# EAGLE design Ziliani-Sistema_Irrigazione (EAGLE 9.6.1)
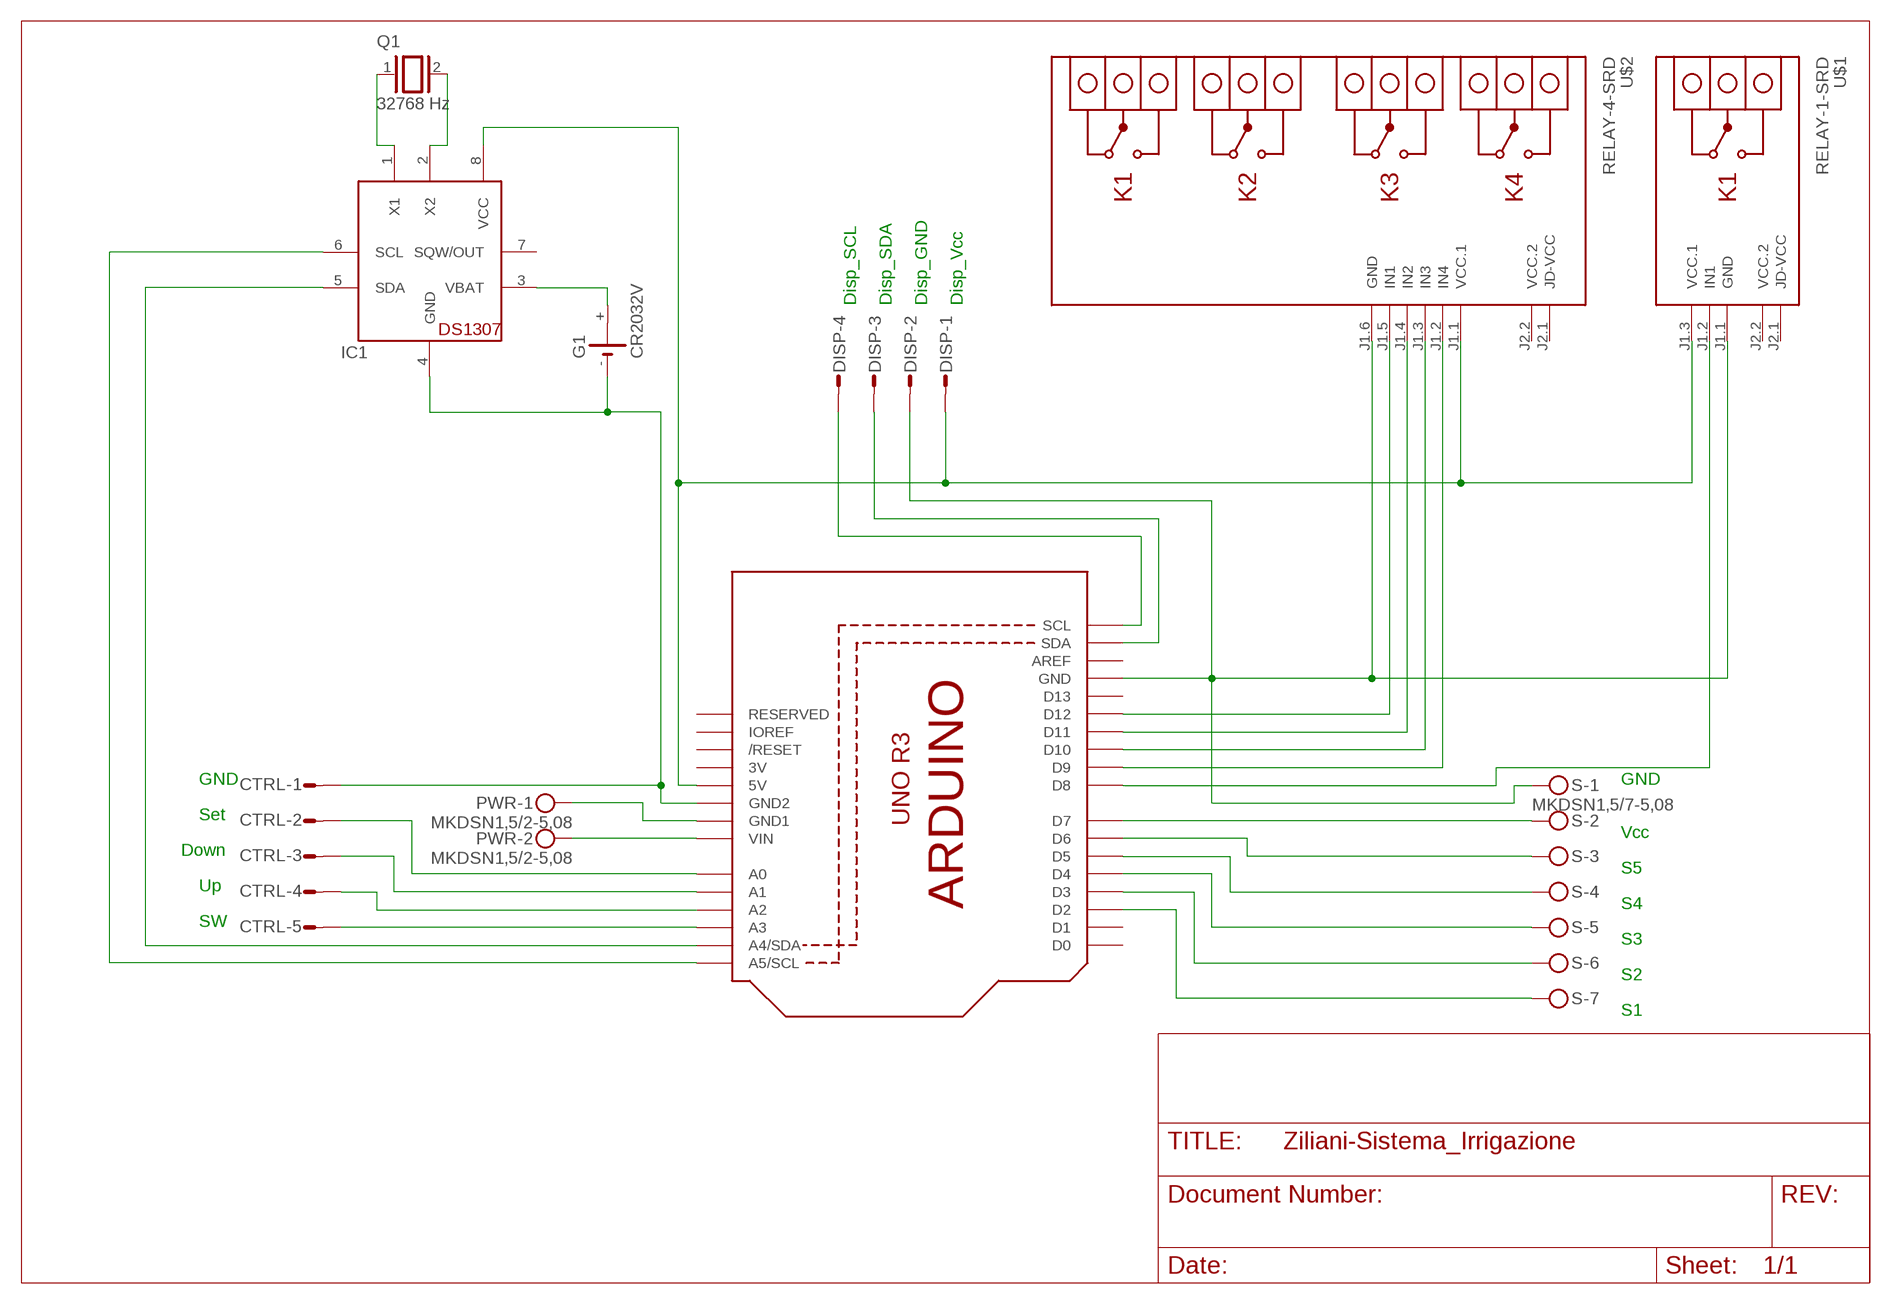
[diagram p0: schematic, sheet 1]

## Parts
CTRL  L05P  [L05P]
DISP  L04P  [L04P]
G1  CR2032V  [CR2032V]
IC1  DS1307  [DIL08]
PWR  MKDSN1,5/2-5,08  [MKDSN1,5/2-5,08]
Q1  32768 Hz  XTAL/S  [QS]
S  MKDSN1,5/7-5,08  [MKDSN1,5/7-5,08]
U1  ARDUINOR3-DIMENSION  [ARDUINOR3]
U$1  RELAY-1-SRD  [RELAY-1-SRD]
U$2  RELAY-4-SRD  [RELAY-4-SRD]

## Nets
GND: PWR.1 U1.GND1
N$1: G1.+ IC1.3(VBAT)
N$2: DISP.4 U1.SCL
N$3: IC1.2(X2) Q1.2
N$4: IC1.1(X1) Q1.1
N$5: CTRL.2 U1.A0
N$6: IC1.5(SDA) U1.A4(A4/SDA)
N$7: IC1.6(SCL) U1.A5(A5/SCL)
N$8: CTRL.1 G1.- IC1.4(GND) U1.GND2
N$9: CTRL.3 U1.A1
N$10: CTRL.4 U1.A2
N$11: CTRL.5 U1.A3
N$12: PWR.2 U1.VIN
N$13: DISP.1 IC1.8(VCC) U1.5V U$1.J1.3(VCC.1) U$2.J1.1(VCC.1)
N$14: U1.D11 U$2.J1.4(IN2)
N$15: DISP.2 S.1 U1.GND U$1.J1.1(GND) U$2.J1.6(GND)
N$16: S.7 U1.D2
N$17: S.6 U1.D3
N$18: S.5 U1.D4
N$19: S.4 U1.D5
N$20: S.3 U1.D6
N$21: S.2 U1.D7
N$22: DISP.3 U1.SDA
N$23: U1.D8 U$1.J1.2(IN1)
N$24: U1.D10 U$2.J1.3(IN3)
N$25: U1.D9 U$2.J1.2(IN4)
N$26: U1.D12 U$2.J1.5(IN1)
Unconnected: G1.+@1(+) IC1.7(SQW/OUT) U1.AREF U1.D0 U1.D1 U1.D13 U1.IOREF U1.RESERVED U1.RESET(/RESET) U$1.J2.1(JD-VCC) U$2.J2.1(JD-VCC)

## Notes on the sheet
- Disp_SCL | Disp_SDA | Disp_GND | Disp_Vcc
- GND | GND
- Set
- Vcc
- Down
- S5
- Up
- S4
- SW
- S3
- S2
- S1

## Power pins joined to a net without a drawn wire
3V: U1.3V
VCC.2: U$1.J2.2(VCC.2) U$2.J2.2(VCC.2)

## Library data of the parts
CTRL = con-amp-mt:L05P: AMP MT CONNECTOR; OC_FARNELL: unknown; OC_NEWARK: unknown
DISP = con-amp-mt:L04P: AMP MT CONNECTOR; OC_FARNELL: unknown; OC_NEWARK: unknown
G1 = battery:CR2032V: LI BATTERY Varta
IC1 = adafruit:DS1307: DS1307 Real time clock (RTC) with battery backup ability. Talk to it via i2c
PWR = con-phoenix-508:MKDSN1,5/2-5,08: MKDSN 1,5/ 2-5,08 Printklemme Nennstrom: 13,5 A Nennspannung: 250 V Rastermaß: 5,08 mm Polzahl: 2 Anschlussart: Schraubanschluss Montage: Löten Anschlussrichtung Leiter/Platine: 0 ° Artikelnummer: 1729128 Source: http://eshop.phoenixcontact.com .. 1729128.pdf
Q1 = special:XTAL/S: CRYSTAL
S = con-phoenix-508:MKDSN1,5/7-5,08: MKDSN 1,5/ 7-5,08 Printklemme Nennstrom: 13,5 A Nennspannung: 250 V Rastermaß: 5,08 mm Polzahl: 7 Anschlussart: Schraubanschluss Montage: Löten Anschlussrichtung Leiter/Platine: 0 ° Artikelnummer: 1729173 Source: http://eshop.phoenixcontact.com .. 1729173.pdf
U1 = adafruit-MOD:ARDUINOR3: This is a new object for the new Arduino R3 - with extra pins that you may want to use (such as IOref, and duplicated A4/A5
U$1 = diy-modules-PCB:RELAY-1-SRD: 1-Channel Relay Module based on SRD-05VDC-SL-C relays Click here to find device on ebay.com <http://www.ebay.com/sch/one+channel+isolated+relay+5v>
U$2 = diy-modules-PCB:RELAY-4-SRD: 4-Channel Relay Module based on SRD-05VDC-SL-C relays Click here to find device on ebay.com <http://www.ebay.com/sch/four+channel+relay+module+optocoupler+5v>

## Board
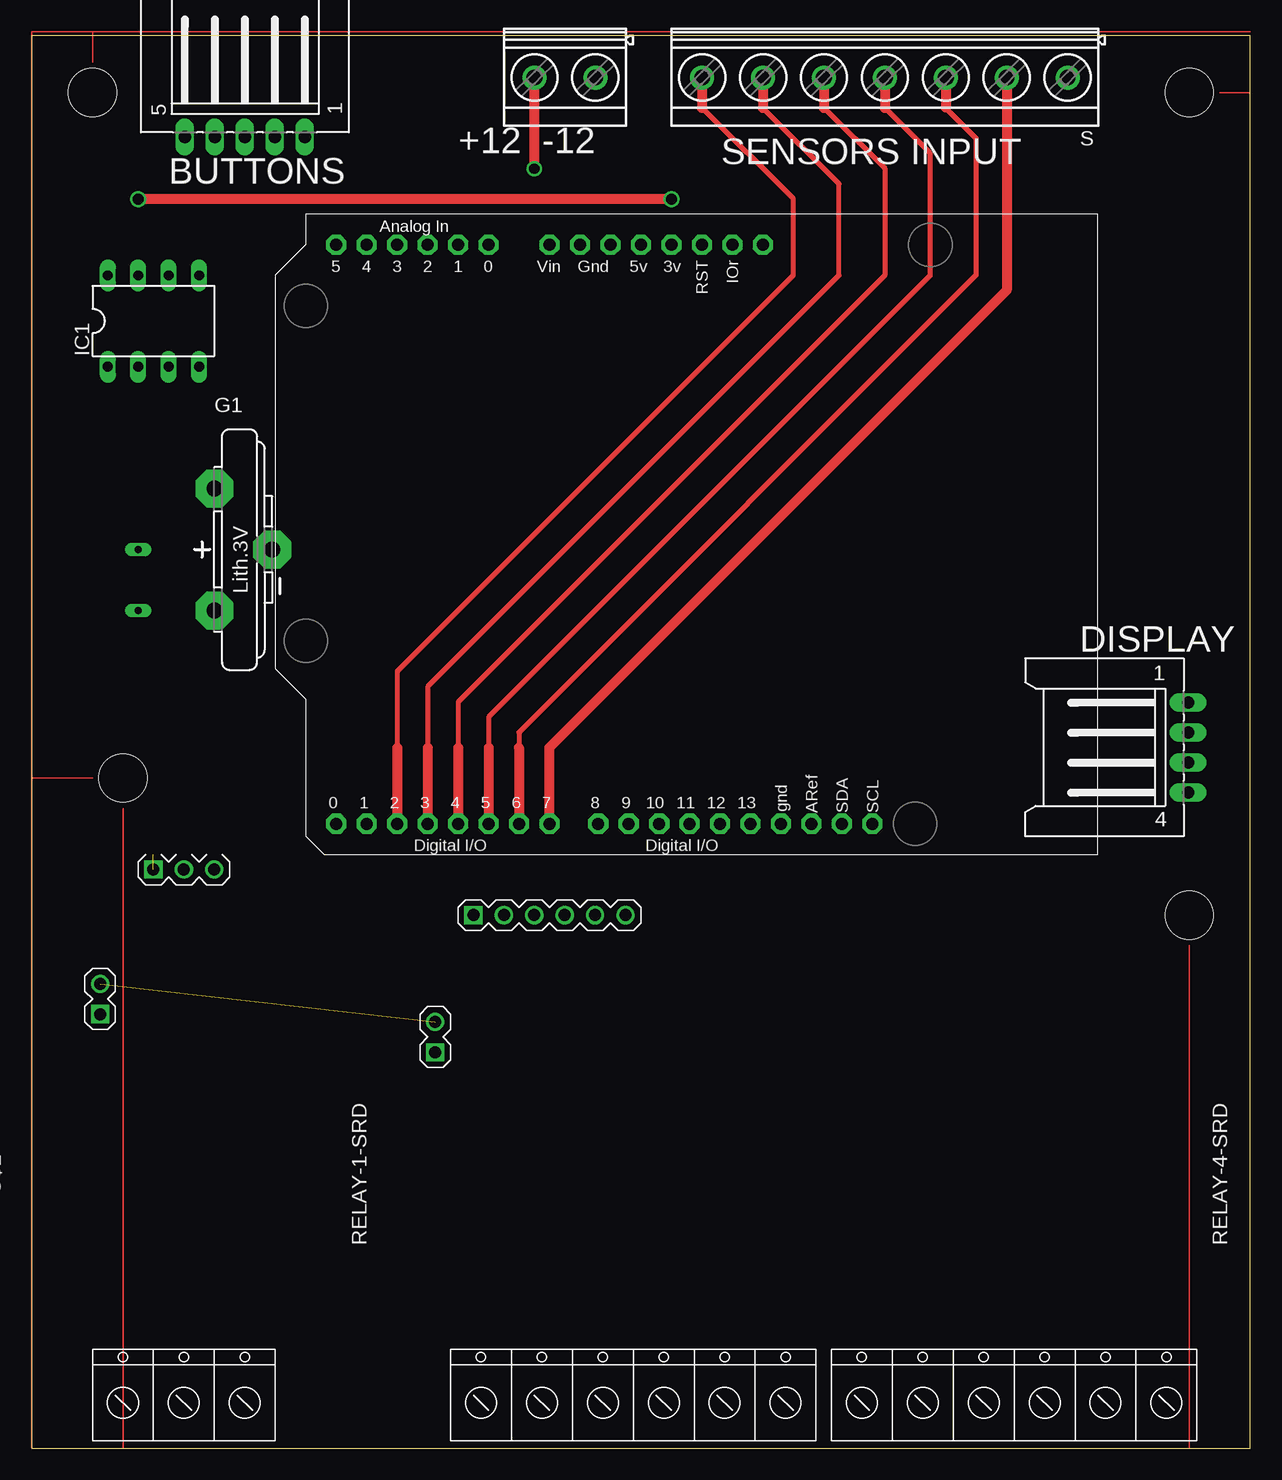
[diagram p1: board, top side]
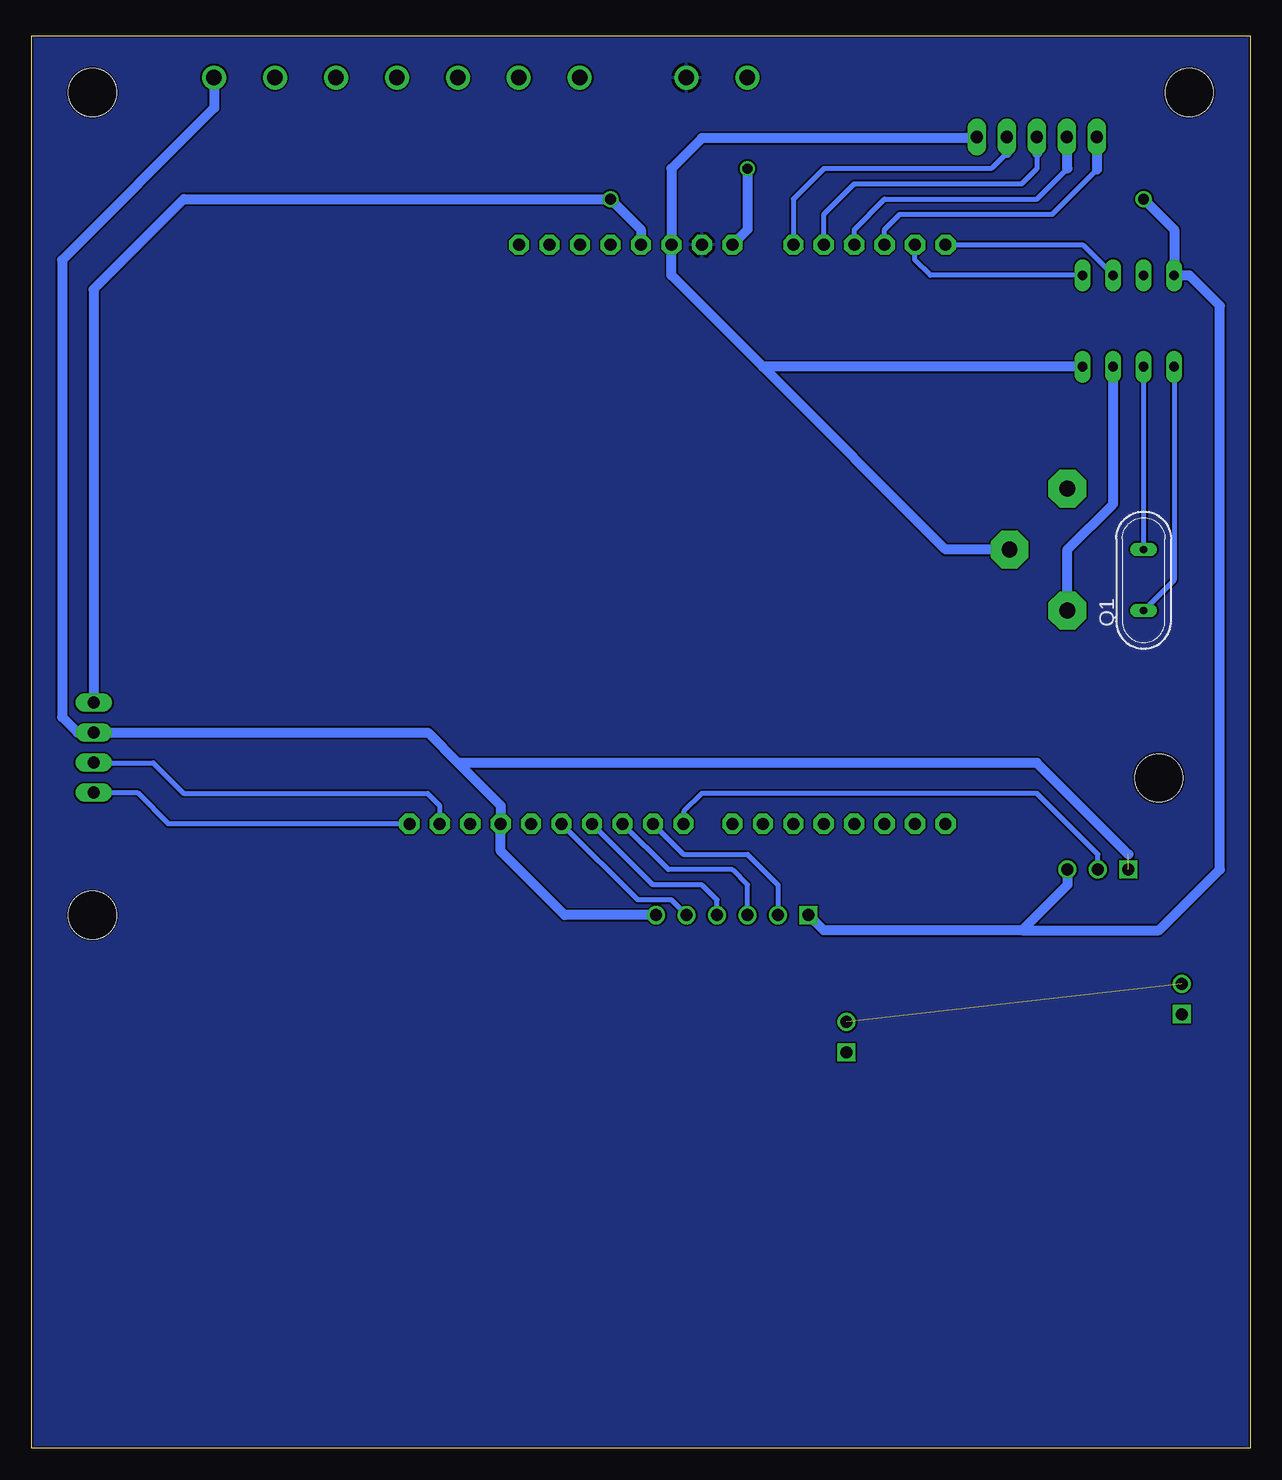
[diagram p2: board, bottom side, seen from below]

Size 101.58 x 117.78 mm. Coordinates in mm from the lower left corner, seen from the top.
Outline: 0,0 101.58,0 101.58,117.78 0,117.78 0,0
Copper layers (1*16): Top 0.035mm / dielectric 1.5mm / Bottom 0.035mm
Design rules "default *": minimum track width 6mil, minimum drill 0.35mm, track to track 6mil, track to pad 6mil, pad to pad 6mil, via to via 6mil, smd to smd 6mil, copper to edge 6mil, drill to drill 6mil, minimum pad ring 10mil, minimum via ring 8mil, stop-mask expansion 4mil, vias tented up to drill 0mil, thermal gap 10mil
Holes 4 mm at 7.62,55.88 96.52,113.03 96.52,44.45 5.08,113.03

### Footprints (pad centres in the part's own frame; a part is rotated, then mirrored left to right if it is on the bottom)
L05P = drill 1.016 long: 1 5,-6.25; 2 2.5,-6.25; 3 0,-6.25; 4 -2.5,-6.25; 5 -5,-6.25
L04P = drill 1.016 long: 1 3.75,-6.25; 2 1.25,-6.25; 3 -1.25,-6.25; 4 -3.75,-6.25
CR2032V = drill 1.321 pad 3.15 octagon: + -2.54,-5.08; +@1 -2.54,5.08; - 2.286,0
DIL08 = drill 0.813 long: 1 -3.81,-3.81; 2 -1.27,-3.81; 3 1.27,-3.81; 4 3.81,-3.81; 5 3.81,3.81; 6 1.27,3.81; 7 -1.27,3.81; 8 -3.81,3.81
MKDSN1,5/2-5,08 = drill 1.3 pad 2: 1 -2.561,0.025; 2 2.519,0.025
QS = drill 0.61 long: 1 -2.54,0; 2 2.54,0
MKDSN1,5/7-5,08 = drill 1.3 pad 2: 1 -15.261,0.025; 2 -10.181,0.025; 3 -5.101,0.025; 4 -0.021,0.025; 5 5.059,0.025; 6 10.139,0.025; 7 15.219,0.025
ARDUINOR3 = drill 1 pad 1.676 octagon: 3V 35.56,2.54; 5V 38.1,2.54; A0 50.8,2.54; A1 53.34,2.54; A2 55.88,2.54; A3 58.42,2.54; A4 60.96,2.54; A5 63.5,2.54; AREF 23.876,50.8; D0 63.5,50.8; D1 60.96,50.8; D2 58.42,50.8; D3 55.88,50.8; D4 53.34,50.8; D5 50.8,50.8; D6 48.26,50.8; D7 45.72,50.8; D8 41.656,50.8; D9 39.116,50.8; D10 36.576,50.8; D11 34.036,50.8; D12 31.496,50.8; D13 28.956,50.8; GND 26.416,50.8; GND1 43.18,2.54; GND2 40.64,2.54; IOREF 30.48,2.54; RESERVED 27.94,2.54; RESET 33.02,2.54; SCL 18.796,50.8; SDA 21.336,50.8; VIN 45.72,2.54
RELAY-1-SRD = drill 1 square: J1.1 25.4,2.54; J2.1 13.335,6.985 | drill 1: J1.2 25.4,0; J1.3 25.4,-2.54; J2.2 15.875,6.985
RELAY-4-SRD = drill 1 square: J1.1 21.59,29.21; J2.1 10.16,32.385 | drill 1: J1.2 21.59,26.67; J1.3 21.59,24.13; J1.4 21.59,21.59; J1.5 21.59,19.05; J1.6 21.59,16.51; J2.2 12.7,32.385

### Placement (x,y rotation side)
CTRL  17.78,115.57 0 top
DISP  90.17,58.42 90 top
G1  17.78,74.93 0 top
IC1  10.16,93.98 0 top
PWR  44.45,114.3 180 top
Q1  8.89,72.39 90 bottom
S  71.12,114.3 180 top
U1  88.9,102.87 180 top
U$1  12.7,22.86 90 top
U$2  66.04,22.86 90 top

### Tracks (layer width: path | path; a pad name or v marks a point on that pad's centre or on a via)
GND
  pour Bottom: 101.6,0 0,0 0,118.11 101.6,118.11
N$1
  Bottom 0.813: G1.+ 15.24,74.93 11.43,78.74 IC1.3
N$2
  Bottom 0.406: U1.SCL 90.17,52.07 92.77,54.67 DISP.4
N$3
  Bottom 0.406: Q1.2 IC1.2
N$4
  Bottom 0.406: IC1.1 6.35,72.39 Q1.1
N$5
  Bottom 0.406: 20.28,107.99 21.59,106.68 35.56,106.68 38.1,104.14 U1.A0
  Bottom 0.813: 20.32,109.28 CTRL.2 20.28,107.99
N$6
  Bottom 0.406: IC1.5 26.67,97.79 27.94,99.06 U1.A4
N$7
  Bottom 0.406: U1.A5 13.97,100.33 IC1.6
N$8
  Bottom 0.813: CTRL.1 22.88,109.22 45.72,109.22 48.26,106.68 U1.GND2 48.26,97.79 40.64,90.17 | G1.- 25.4,74.93 40.64,90.17 | IC1.4 40.64,90.17
N$9
  Bottom 0.406: 17.78,107.95 17.78,106.68 19.05,105.41 33.02,105.41 35.56,102.87 U1.A1
  Bottom 0.813: CTRL.3 17.78,107.95
N$10
  Bottom 0.406: U1.A2 33.02,101.6 30.48,104.14 17.78,104.14 15.24,106.68
  Bottom 0.813: CTRL.4 15.28,106.72 15.24,106.68 15.24,109.28 CTRL.4
N$11
  Bottom 0.406: U1.A3 30.48,101.6 29.21,102.87 16.51,102.87 12.78,106.6
  Bottom 0.813: CTRL.5 12.78,106.6
N$12  (via drill 0.85)
  Top 0.813: PWR.2 41.91,114.25 v41.91,106.68
  Bottom 0.813: U1.VIN 41.91,101.6 v41.91,106.68
N$13  (via drill 0.9)
  Top 0.813: v53.34,104.14 v8.89,104.14
  Bottom 0.813: U$2.J1.1 35.56,43.18 19.05,43.18 | v8.89,104.14 6.35,101.6 IC1.8 5.08,97.79 2.54,95.25 2.54,48.26 7.62,43.18 19.05,43.18 | DISP.1 96.42,96.62 88.9,104.14 v53.34,104.14 50.8,101.6 U1.5V | U$1.J1.3 15.24,46.99 19.05,43.18
N$14
  Bottom 0.406: U1.D11 49.78,46.99 45.72,46.99 44.45,45.72 U$2.J1.4
N$15  (1 unrouted)
  Bottom 0.813: S.1 86.36,114.25 86.36,111.76 99.06,99.06 99.06,60.96 97.77,59.67 DISP.2 68.56,59.67 66.04,57.15 | 66.04,57.15 62.48,53.59 U1.GND 62.48,49.78 57.15,44.45 U$2.J1.6 | 10.16,49.53 17.78,57.15 66.04,57.15
N$16
  Top 0.406: 30.48,58.42 30.48,64.77 63.5,97.79 63.5,104.18 55.9,111.78
  Top 0.813: S.7 55.9,111.78 55.88,111.76 | 30.48,58.42 U1.D2
N$17
  Top 0.406: 60.98,111.78 60.94,111.78 67.31,105.41 67.31,97.79 33.02,63.5 33.02,58.42
  Top 0.813: S.6 60.98,111.78 60.96,111.76 | 33.02,58.42 U1.D3
N$18
  Top 0.406: 66.06,111.78 71.12,106.72 71.12,97.79 35.56,62.23 35.56,58.42
  Top 0.813: S.5 66.06,111.78 66.04,111.76 | 35.56,58.42 U1.D4
N$19
  Top 0.406: 71.12,111.76 74.93,107.95 74.93,97.79 38.1,60.96 38.1,58.42
  Top 0.813: S.4 71.14,111.78 71.12,111.76 | 38.1,58.42 U1.D5
N$20
  Top 0.406: 76.22,111.78 76.22,111.74 78.74,109.22 78.74,97.79 40.64,59.69 40.64,58.42
  Top 0.813: S.3 76.22,111.78 | 40.64,58.42 U1.D6
N$21
  Top 0.406: 67.31,82.55 43.18,58.42
  Top 0.813: S.2 81.3,111.78 | 81.3,111.78 81.28,111.76 | U1.D7 43.18,58.42 81.3,96.54 81.3,111.78
N$22
  Bottom 0.406: DISP.3 96.4,57.15 91.44,57.15 88.9,54.61 68.58,54.61 67.56,53.59 U1.SDA
N$23
  Bottom 0.406: U1.D8 47.24,53.09 45.72,54.61 17.78,54.61 12.7,49.53 U$1.J1.2
N$24
  Bottom 0.406: U1.D10 48.51,48.26 43.18,48.26 41.91,46.99 U$2.J1.3
N$25
  Bottom 0.406: U1.D9 47.24,49.53 41.91,49.53 39.37,46.99 U$2.J1.2
N$26
  Bottom 0.406: U$2.J1.5 48.26,45.72 51.05,45.72 U1.D12
VCC.2  (1 unrouted)
(copper drawn outside any net)
  shapes: Top area x8

### Text on the board
tNames: SENSORS INPUT | +12 -12 | BUTTONS | DISPLAY